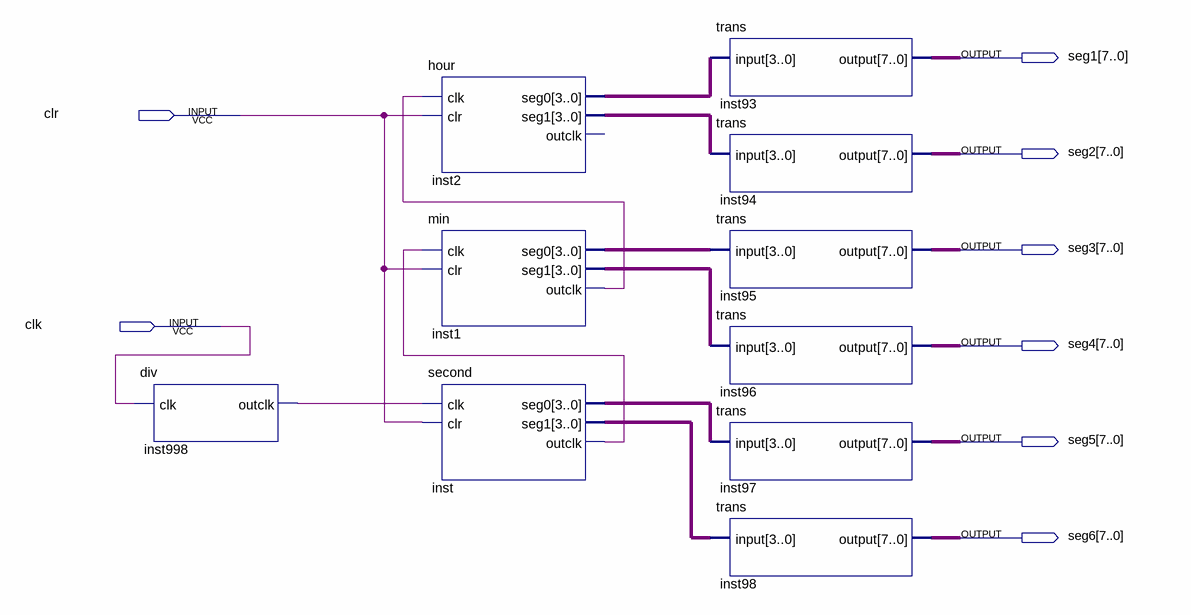
[diagram p0: schematic sheet]
// Quartus schematic clock2.bdf as structural Verilog: 10 symbols, 8 pins
module clock2 (
  input  clr,
  input  clk,
  output [7:0] seg1,
  output [7:0] seg2,
  output [7:0] seg3,
  output [7:0] seg4,
  output [7:0] seg5,
  output [7:0] seg6
);

  wire inst1_outclk, inst998_outclk, inst_outclk;
  wire [3:0] inst1_seg0, inst1_seg1, inst2_seg0, inst2_seg1, inst_seg0, inst_seg1;

  div inst998 (.clk(clk), .outclk(inst998_outclk));
  hour inst2 (.clk(inst1_outclk), .clr(clr), .seg0(inst2_seg0), .seg1(inst2_seg1));  // open: outclk
  min inst1 (.clk(inst_outclk), .clr(clr), .seg0(inst1_seg0), .seg1(inst1_seg1), .outclk(inst1_outclk));
  second inst (.clk(inst998_outclk), .clr(clr), .seg0(inst_seg0), .seg1(inst_seg1), .outclk(inst_outclk));
  trans inst93 (.\input (inst2_seg0), .\output (seg1));
  trans inst94 (.\input (inst2_seg1), .\output (seg2));
  trans inst95 (.\input (inst1_seg0), .\output (seg3));
  trans inst96 (.\input (inst1_seg1), .\output (seg4));
  trans inst97 (.\input (inst_seg0), .\output (seg5));
  trans inst98 (.\input (inst_seg1), .\output (seg6));
endmodule
